# Altium schematic sheet power.SchDoc
size 420 x 297 mm; Scale: 1:1; DocumentType: Схема электрическая принципиальная; FirstReferrence: АБВГ.123456.001
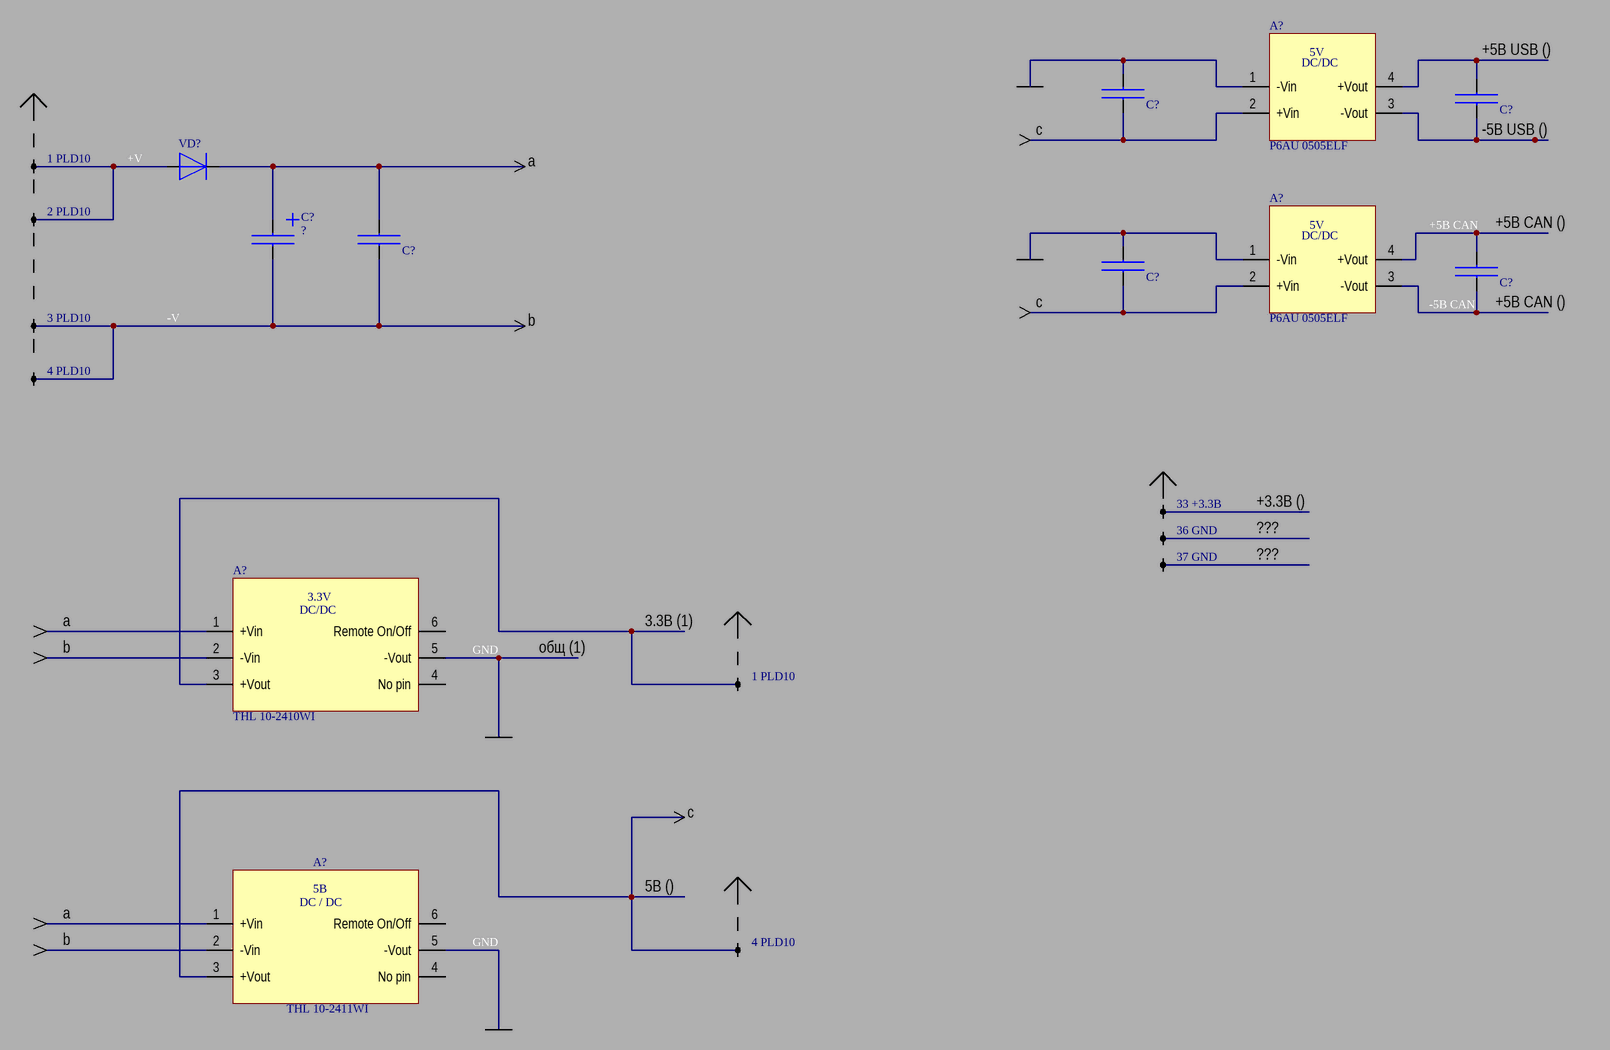
[diagram p0: power.SchDoc]

## Parts
(Parts that share a designator on the sheet are numbered #1, #2 ... from top to bottom, then left to right.)
A?#1  P6AU 0505ELF  [SIP4]
A?#2  P6AU 0505ELF  [SIP4]
A?#3  THL 10-2410WI  [compact1x1case]
A?#4  THL 10-2411WI  [compact1x1case]
C?#1  ?  [CAP0805]  (value not drawn)
C?#2  ?  [CAP0805]  (value not drawn)
C?#3  ?  [CAPT]
C?#4  ?  [CAP0805]  (value not drawn)
C?#5  ?  [CAP0805]  (value not drawn)
C?#6  ?  [CAP0805]  (value not drawn)
VD?  BAV102  [BAV102]  (value not drawn)
X3  1 PLD10  [PLD10]  (parts A,B,C of 10)
X4  1 PLD10  [PLD10]  (parts A,B,D of 10)
X?#1  33 +3.3В  [PLD40]  (part 33 of 40)
X?#2  36 GND  [PLD40]  (part 36 of 40)
X?#3  37 GND  [PLD40]  (part 37 of 40)

## Nets
+5В CAN: A?#2.4(+Vout) C?#6.2
+V: VD?.1 X3.1 X3.2
-5В CAN: A?#2.3(-Vout) C?#6.1
-V: C?#3.2 C?#4.1 X3.3 X4.4
GND: A?#3.5(-Vout) A?#4.5(-Vout)
NetA?#1_1: A?#1.1(-Vin) C?#1.2
NetA?#1_2: A?#1.2(+Vin) C?#1.1
NetA?#1_3: A?#1.3(-Vout) C?#2.1
NetA?#1_4: A?#1.4(+Vout) C?#2.2
NetA?#2_1: A?#2.1(-Vin) C?#5.2
NetA?#2_2: A?#2.2(+Vin) C?#5.1
NetA?#3_3: A?#3.3(+Vout) X4.1
NetA?#4_3: A?#4.3(+Vout) X4.2
NetC?#3_1: C?#3.1 C?#4.2 VD?.2

Not connected (* = marked no-connect by the designer): A?#3 1(+Vin) 2(-Vin) 4(No_pin) 6(Remote_On/Off); A?#4 1(+Vin) 2(-Vin) 4(No_pin) 6(Remote_On/Off); X?#1 33(1); X?#2 36(1); X?#3 37(1)

## Notes on the sheet
- (near C?#2) +5В USB ()
- a
- c
- (near C?#2) -5В USB ()
- (near C?#6) +5В CAN ()
- b
- +3.3В ()
- ???
- общ (1)
- 3.3В (1)
- 5В ()
- Подп. и дата
- Инв. № дубл.
- Взам. инв. №
- Инв. № подл.
- Изм.
- Лист
- № докум.
- Подп.
- Дата
- 2.106-A3
- Копировал
- Формат А3
- (in symbol P6AU 0505ELF) 5V; DC/DC
- (in symbol THL 10-2410WI) 3.3V; DC/DC
- (in symbol THL 10-2411WI) 5В; DC / DC

## Library data of the parts
C?#1 C?#2 C?#4-C?#6 = C_2
C?#3 = C_4
X3 X4 = PLD10
X?#1-X?#3 = PLD40